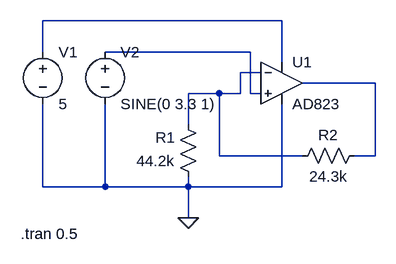
[diagram p0: schematic opamp_voltage_follower.asc]
opamp_voltage_follower.asc, the LTspice schematic file:
Version 4
SHEET 1 880 680
WIRE 176 32 -192 32
WIRE -192 80 -192 32
WIRE 128 80 -96 80
WIRE 176 96 176 32
WIRE 144 112 112 112
WIRE 320 128 208 128
WIRE 80 144 32 144
WIRE 112 144 112 112
WIRE 112 144 80 144
WIRE 128 144 128 80
WIRE 144 144 128 144
WIRE 32 192 32 144
WIRE 80 240 80 144
WIRE 208 240 80 240
WIRE 320 240 320 128
WIRE 320 240 288 240
WIRE -192 288 -192 160
WIRE -96 288 -96 160
WIRE -96 288 -192 288
WIRE 32 288 32 272
WIRE 32 288 -96 288
WIRE 176 288 176 160
WIRE 176 288 32 288
WIRE 32 336 32 288
FLAG 32 336 0
SYMBOL Opamps\\AD823 176 64 R0
SYMATTR InstName U1
SYMBOL res 48 288 R180
WINDOW 0 36 76 Left 2
WINDOW 3 36 40 Left 2
SYMATTR InstName R1
SYMATTR Value 44.2k
SYMBOL res 192 256 R270
WINDOW 0 32 56 VTop 2
WINDOW 3 0 56 VBottom 2
SYMATTR InstName R2
SYMATTR Value 24.3k
SYMBOL voltage -192 64 R0
WINDOW 123 0 0 Left 2
WINDOW 39 0 0 Left 2
SYMATTR InstName V1
SYMATTR Value 5
SYMBOL voltage -96 64 R0
WINDOW 123 0 0 Left 2
WINDOW 39 0 0 Left 2
SYMATTR InstName V2
SYMATTR Value SINE(0 3.3 1)
TEXT -226 360 Left 2 !.tran 0.5

The netlist it stands for:
* opamp_voltage_follower.asc
XU1 N002 N003 N001 0 N004 AD823  ; pins In+ In- V+ V- OUT
R1 0 N003 44.2k
R2 N003 N004 24.3k
V1 N001 0 5
V2 N002 0 SINE(0 3.3 1)
.tran 0.5
.lib ADI.lib
.backanno
.end